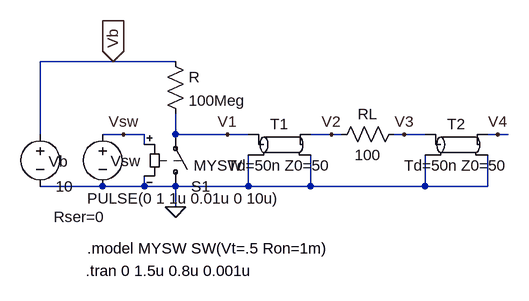
[diagram p0: schematic 1.23.asc]
1.23.asc, the LTspice schematic file:
Version 4
SHEET 1 880 680
WIRE -272 128 -272 16
WIRE -176 208 -272 208
WIRE -160 16 -272 16
WIRE -144 128 -176 128
WIRE -112 128 -144 128
WIRE -112 144 -112 128
WIRE -112 208 -176 208
WIRE -112 208 -112 192
WIRE -64 16 -160 16
WIRE -64 128 -64 96
WIRE -64 208 -112 208
WIRE -64 240 -64 208
WIRE 16 128 -64 128
WIRE 48 128 16 128
WIRE 48 208 -64 208
WIRE 48 208 48 160
WIRE 144 208 48 208
WIRE 144 208 144 160
WIRE 176 128 144 128
WIRE 192 128 176 128
WIRE 288 128 272 128
WIRE 320 128 288 128
WIRE 320 208 144 208
WIRE 320 208 320 160
WIRE 416 208 320 208
WIRE 416 208 416 160
WIRE 432 128 416 128
WIRE 448 128 432 128
FLAG -64 240 0
FLAG -160 16 Vb
IOPIN -160 16 In
FLAG 16 128 V1
FLAG 176 128 V2
FLAG 288 128 V3
FLAG 432 128 V4
FLAG -144 128 Vsw
SYMBOL tline 96 144 R0
SYMATTR InstName T1
SYMBOL res -80 0 R0
SYMATTR InstName R
SYMATTR Value 100Meg
SYMBOL sw -64 224 M180
WINDOW 3 28 48 Left 0
SYMATTR InstName S1
SYMATTR Value MYSW
SYMBOL voltage -176 112 R0
WINDOW 123 0 0 Left 0
WINDOW 39 0 0 Left 0
WINDOW 0 12 57 Left 0
WINDOW 3 -24 115 Left 0
SYMATTR InstName Vsw
SYMATTR Value PULSE(0 1 1u 0.01u 0 10u)
SYMBOL voltage -272 112 R0
WINDOW 123 0 0 Left 0
WINDOW 39 21 143 Left 0
WINDOW 0 13 58 Left 0
SYMATTR SpiceLine Rser=0
SYMATTR InstName Vb
SYMATTR Value 10
SYMBOL res 288 112 R90
WINDOW 0 0 56 VBottom 0
WINDOW 3 32 56 VTop 0
SYMATTR InstName RL
SYMATTR Value 100
SYMBOL tline 368 144 R0
SYMATTR InstName T2
TEXT -202 338 Left 0 !.tran 0 1.5u 0.8u 0.001u
TEXT -200 304 Left 0 !.model MYSW SW(Vt=.5 Ron=1m)

The netlist it stands for:
* 1.23.asc
T1 V1 0 V2 0 Td=50n Z0=50
R Vb V1 100Meg
S1 0 V1 Vsw 0 MYSW
Vsw Vsw 0 PULSE(0 1 1u 0.01u 0 10u)
Vb Vb 0 10 Rser=0
RL V3 V2 100
T2 V3 0 V4 0 Td=50n Z0=50
.tran 0 1.5u 0.8u 0.001u
.model MYSW SW(Vt=.5 Ron=1m)
.backanno
.end